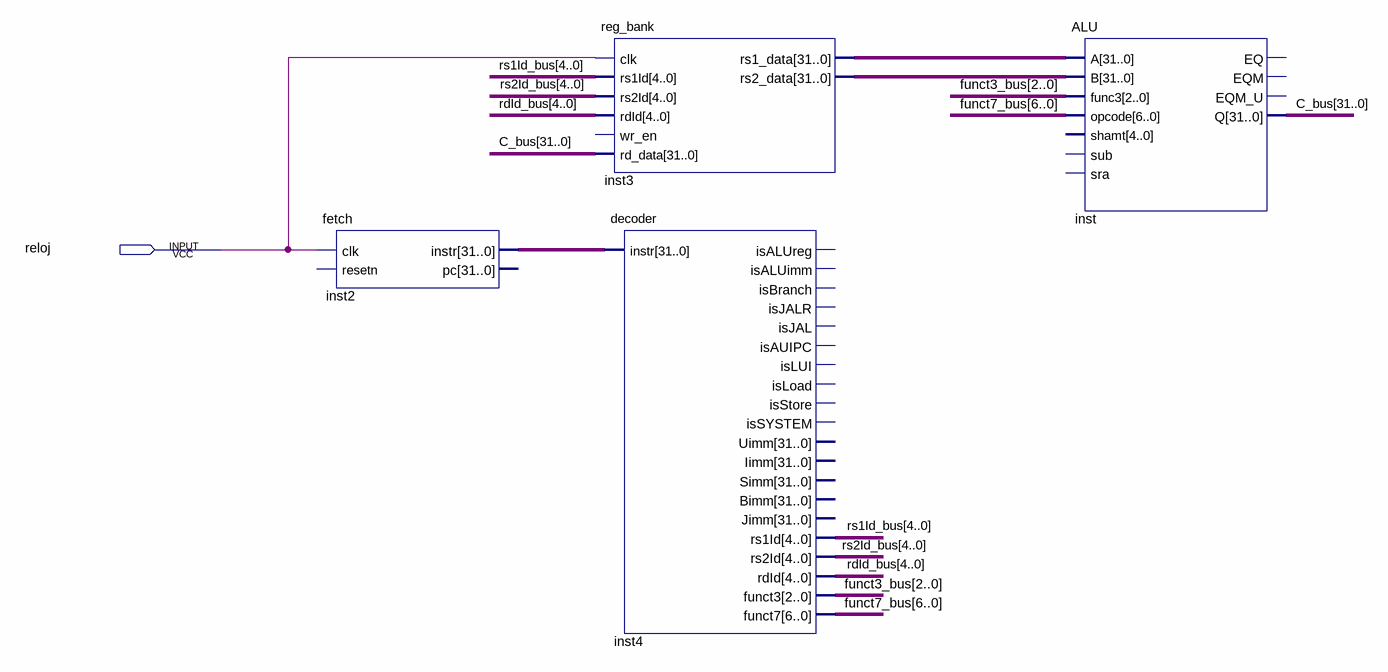
[diagram p0: schematic sheet]
// Quartus schematic micro_v0.bdf as structural Verilog: 4 symbols, 1 pins
module micro_v0 (
  input  reloj
);

  wire [2:0] funct3_bus;
  wire [4:0] rdId_bus, rs1Id_bus, rs2Id_bus;
  wire [6:0] funct7_bus;
  wire [31:0] C_bus, inst2_instr, inst3_rs1_data, inst3_rs2_data;

  fetch inst2 (.clk(reloj), .instr(inst2_instr));  // open: resetn, pc
  reg_bank inst3 (
    .clk(reloj), .rs1Id(rs1Id_bus), .rs2Id(rs2Id_bus), .rdId(rdId_bus), .rd_data(C_bus),
    .rs1_data(inst3_rs1_data), .rs2_data(inst3_rs2_data));  // open: wr_en
  decoder inst4 (
    .instr(inst2_instr), .rs1Id(rs1Id_bus), .rs2Id(rs2Id_bus), .rdId(rdId_bus), .funct3(funct3_bus),
    .funct7(funct7_bus));  // open: isALUreg, isALUimm, isBranch, isJALR, isJAL, isAUIPC, isLUI, isLoad, isStore, isSYSTEM, Uimm, Iimm, Simm, Bimm, Jimm
  ALU inst (
    .A(inst3_rs1_data), .B(inst3_rs2_data), .func3(funct3_bus), .opcode(funct7_bus), .Q(C_bus));  // open: shamt, sub, sra, EQ, EQM, EQM_U
endmodule
